# Altium schematic sheet schematic.SchDoc
size A4; SheetNumber: 6; SheetTotal: 29
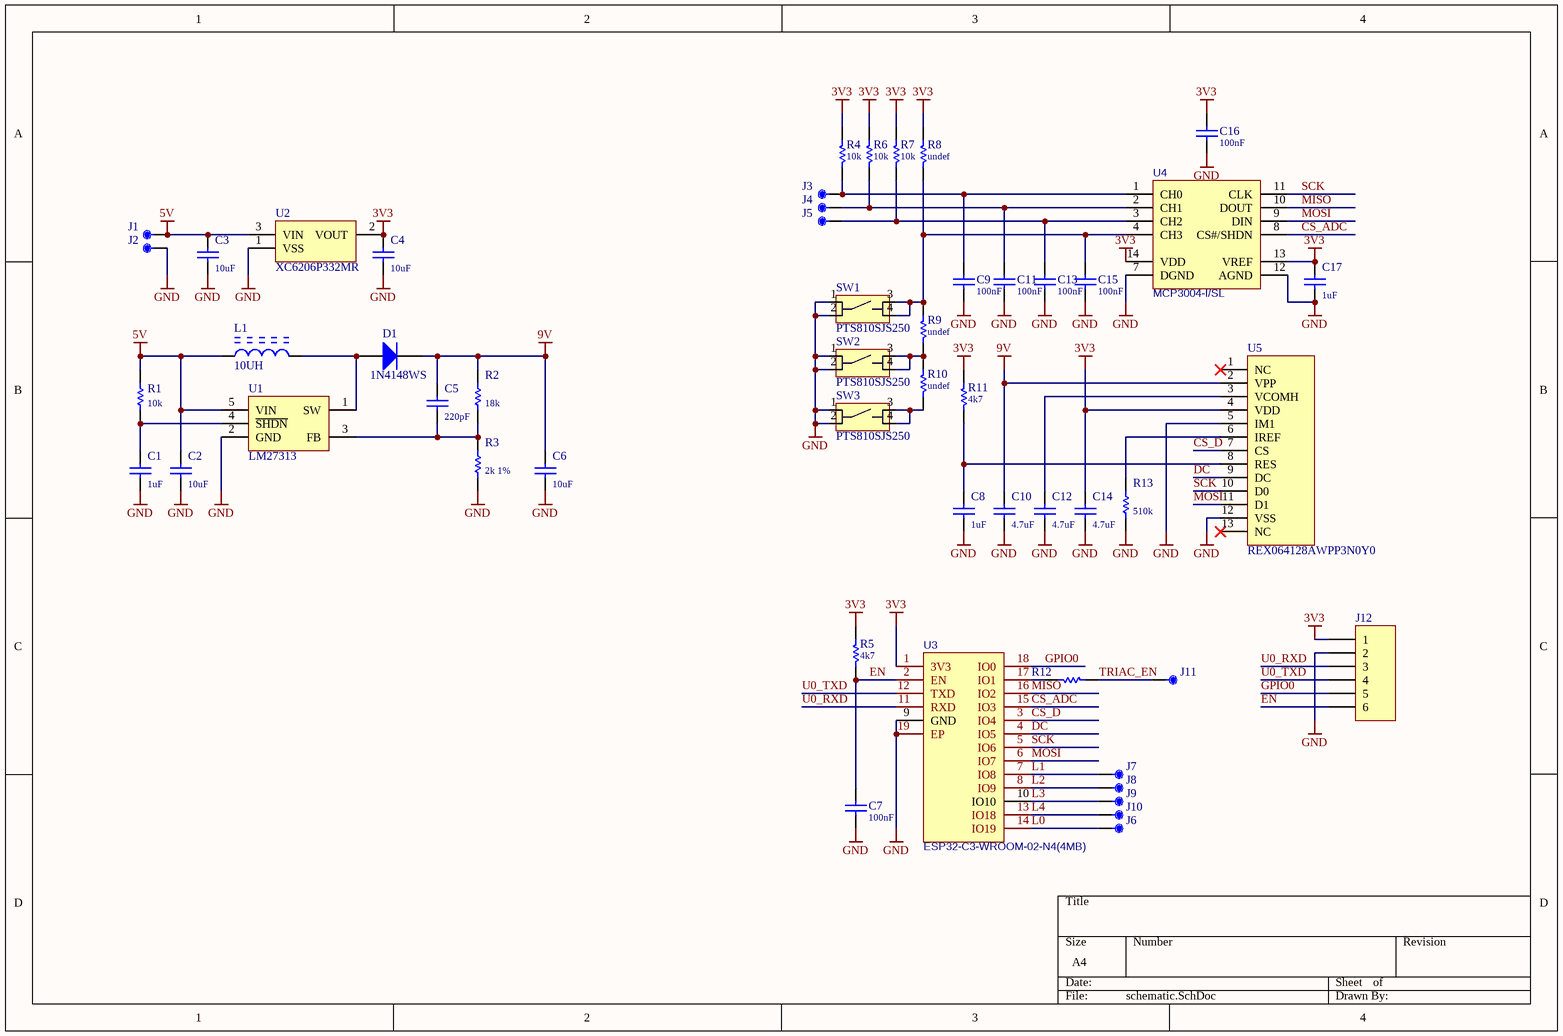
[diagram p0: schematic.SchDoc]

## Parts
C1  1uF  [C0603]
C2  10uF  [C1206]
C3  10uF  [C1206]
C4  10uF  [C1206]
C5  220pF  [C0402]
C6  10uF  [C1206]
C7  100nF  [C0402]
C8  1uF  [C0603]
C9  100nF  [C0402]
C10  4.7uF  [C0805]
C11  100nF  [C0402]
C12  4.7uF  [C0805]
C13  100nF  [C0402]
C14  4.7uF  [C0805]
C15  100nF  [C0402]
C16  100nF  [C0402]
C17  1uF  [C0603]
D1  1N4148WS  [SOD-323]
J1  undef  [TP30_SMD]  (value not drawn)
J2  undef  [TP30_SMD]  (value not drawn)
J3  undef  [TP30_SMD]  (value not drawn)
J4  undef  [TP30_SMD]  (value not drawn)
J5  undef  [TP30_SMD]  (value not drawn)
J6  undef  [TP30_SMD]  (value not drawn)
J7  undef  [TP30_SMD]  (value not drawn)
J8  undef  [TP30_SMD]  (value not drawn)
J9  undef  [TP30_SMD]  (value not drawn)
J10  undef  [TP30_SMD]  (value not drawn)
J11  undef  [TP30_SMD]  (value not drawn)
J12  (no value)  [HDR-1X6]  (no BOM)
L1  10UH  [L2520]
R1  10k  [R0402]
R2  18k  [R0402]
R3  2k 1%  [R0402]
R4  10k  [R0603]
R5  4k7  [R0603]
R6  10k  [R0603]
R7  10k  [R0603]
R8  undef  [R0603]
R9  undef  [R0603]
R10  undef  [R0603]
R11  4k7  [R0603]
R12  undef  [R0603]  (value not drawn)
R13  510k  [R0603]
SW1  PTS810SJS250  [BTN_PTS810]
SW2  PTS810SJS250  [BTN_PTS810]
SW3  PTS810SJS250  [BTN_PTS810]
U1  LM27313  [SOT-23-5]
U2  XC6206P332MR  [SOT-23]
U3  ESP32-C3-WROOM-02-N4(4MB)  [ESP32-C3-WROOM-02-N4-4MB]
U4  MCP3004-I/SL  [SOIC-14]
U5  REX064128AWPP3N0Y0  [REX064128AWPP3N0Y0]  (no BOM)

## Nets
3V3: C4.2 C14.2 C16.2 C17.2 J12.1 R4.2 R5.2 R6.2 R7.2 R8.1 R11.2 U2.2(VOUT) U3.1(3V3) U4.13(VREF) U4.14(VDD) U5.4(VDD)
5V: C2.2 C3.2 J1.1 L1.1 R1.1 U1.5(VIN) U2.3(VIN)
9V: C5.2 C6.2 C10.2 D1.2(K) R2.1 U5.2(VPP)
GND: C1.1 C2.1 C3.1 C4.1 C6.1 C7.1 C8.1 C9.1 C10.1 C11.1 C12.1 C13.1 C14.1 C15.1 C16.1 C17.1 J2.1 J12.2 R3.2 R13.2 SW1.1 SW1.2 SW2.1 SW2.2 SW3.1 SW3.2 U1.2(GND) U2.1(VSS) U3.9(GND) U3.19(EP) U4.7(DGND) U4.12(AGND) U5.5(IM1) U5.12(VSS)
CS_ADC: U3.15(IO3) U4.8(CS#/SHDN)
CS_D: U3.3(IO4) U5.7(CS)
DC: U3.4(IO5) U5.9(DC)
EN: C7.2 J12.6 R5.1 U3.2(EN)
GPIO0: J12.5 U3.18(IO0)
L0: J6.1 U3.14(IO19)
L1: J7.1 U3.7(IO8)
L2: J8.1 U3.8(IO9)
L3: J9.1 U3.10(IO10)
L4: J10.1 U3.13(IO18)
MISO: U3.16(IO2) U4.10(DOUT)
MOSI: U3.6(IO7) U4.9(DIN) U5.11(D1)
SCK: U3.5(IO6) U4.11(CLK) U5.10(D0)
TRIAC_EN: J11.1 R12.1
U0_RXD: J12.3 U3.11(RXD)
U0_TXD: J12.4 U3.12(TXD)
NetC1_2: C1.2 R1.2 U1.4(~{SHDN})
NetC5_1: C5.1 R2.2 R3.1 U1.3(FB)
NetC8_2: C8.2 R11.1 U5.8(RES)
NetC9_2: C9.2 J3.1 R4.1 U4.1(CH0)
NetC11_2: C11.2 J4.1 R6.1 U4.2(CH1)
NetC12_2: C12.2 U5.3(VCOMH)
NetC13_2: C13.2 J5.1 R7.1 U4.3(CH2)
NetC15_2: C15.2 R8.2 R9.1 SW1.3 SW1.4 U4.4(CH3)
NetD1_1: D1.1(A) L1.2 U1.1(SW)
NetR9_2: R9.2 R10.1 SW2.3 SW2.4
NetR10_2: R10.2 SW3.3 SW3.4
NetR12_2: R12.2 U3.17(IO1)
NetR13_1: R13.1 U5.6(IREF)

Not connected (* = marked no-connect by the designer): U5 1(NC)* 13(NC)*

## Library data of the parts
C1 C8 C17 = CAP: 1uF 0603
C2 C6 = CAP: 10uf 25V 1206
C3 C4 = CAP: 10uf 50V 1206
C5 = CAP: 220pF 0402
C7 C9 C11 C13 C15 C16 = CAP: 100nF 0402
C10 C12 C14 = CAP: 4.7uF 50V 0805
D1 = US1M-13-F
J1-J11 = TP_Dup1
J12 = Header 3_1
L1 = SRN3015-100M: VLS252012HBX-100M-1
R1 = RES: 10k 0402
R2 = RES: 18k 0402
R3 = RES: 2k 0402
R4 R6 R7 = RES: 10k 0603
R5 R11 = RES: 4k7 0603
R8-R10 R12 = RES
R13 = RES: 510k 0603
SW1-SW3 = Component_1
U1 = LM27313XMFX: LM27313XMFX/NOPB
U2 = Component_4_1
U5 = Header 3